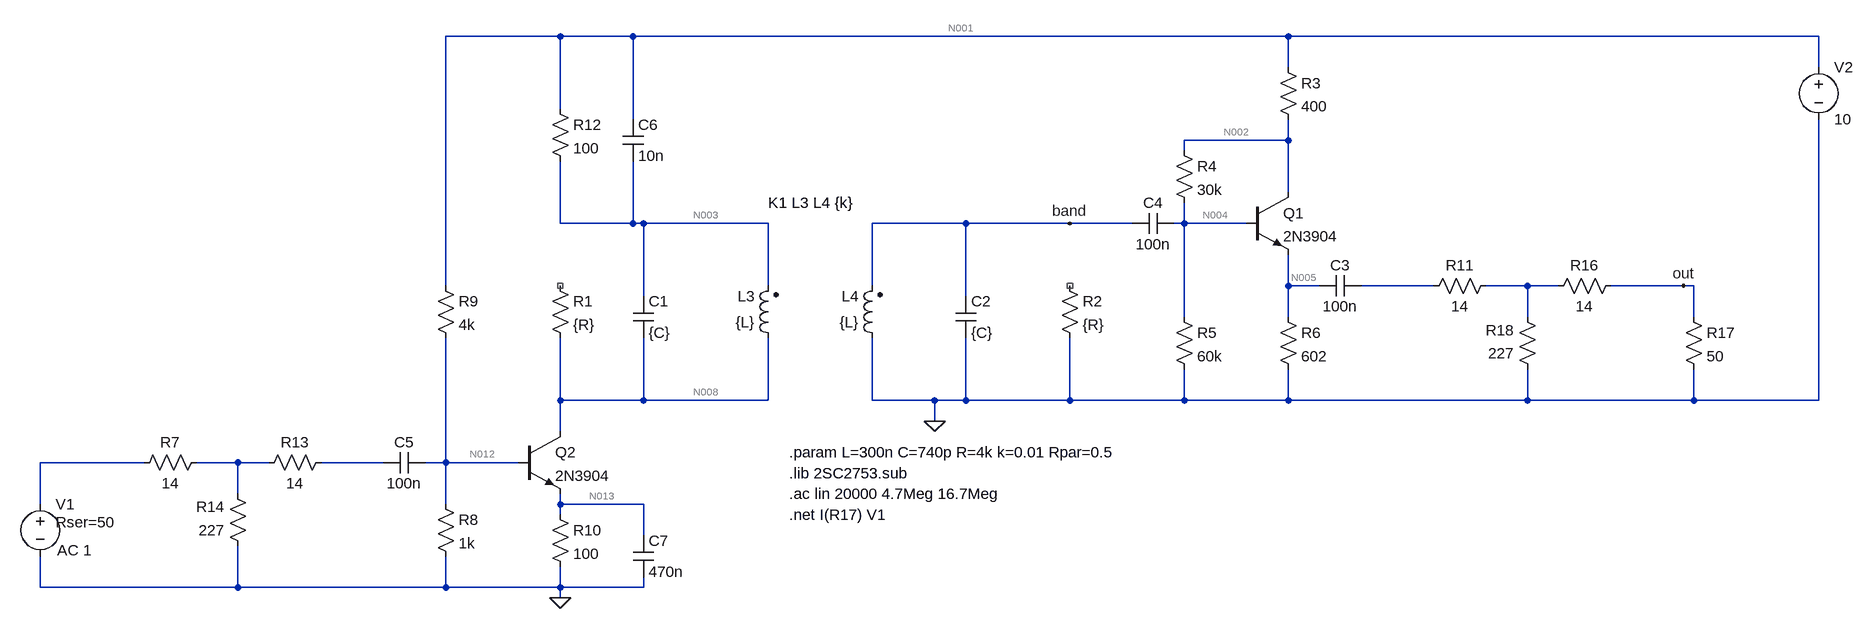
[diagram p0: schematic filter.asc]
filter.asc, the LTspice schematic file:
Version 4
SHEET 1 2536 760
WIRE 256 -176 80 -176
WIRE 368 -176 256 -176
WIRE 1376 -176 368 -176
WIRE 2192 -176 1376 -176
WIRE 1376 -128 1376 -176
WIRE 2192 -128 2192 -176
WIRE 256 -64 256 -176
WIRE 368 -48 368 -176
WIRE 1376 -16 1376 -48
WIRE 1376 -16 1216 -16
WIRE 1216 0 1216 -16
WIRE 1376 64 1376 -16
WIRE 256 112 256 16
WIRE 368 112 368 16
WIRE 368 112 256 112
WIRE 384 112 368 112
WIRE 576 112 384 112
WIRE 880 112 736 112
WIRE 1040 112 880 112
WIRE 1136 112 1040 112
WIRE 1216 112 1216 80
WIRE 1216 112 1200 112
WIRE 1312 112 1216 112
WIRE 80 208 80 -176
WIRE 576 208 576 112
WIRE 736 208 736 112
WIRE 1376 208 1376 160
WIRE 1424 208 1376 208
WIRE 1600 208 1488 208
WIRE 1744 208 1680 208
WIRE 1792 208 1744 208
WIRE 1984 208 1872 208
WIRE 2000 208 1984 208
WIRE 384 224 384 112
WIRE 880 224 880 112
WIRE 1216 256 1216 112
WIRE 1376 256 1376 208
WIRE 1744 256 1744 208
WIRE 2000 256 2000 208
WIRE 256 384 256 288
WIRE 384 384 384 288
WIRE 384 384 256 384
WIRE 576 384 576 288
WIRE 576 384 384 384
WIRE 736 384 736 288
WIRE 832 384 736 384
WIRE 880 384 880 288
WIRE 880 384 832 384
WIRE 1040 384 1040 288
WIRE 1040 384 880 384
WIRE 1216 384 1216 336
WIRE 1216 384 1040 384
WIRE 1376 384 1376 336
WIRE 1376 384 1216 384
WIRE 1744 384 1744 336
WIRE 1744 384 1376 384
WIRE 2000 384 2000 336
WIRE 2000 384 1744 384
WIRE 2192 384 2192 -48
WIRE 2192 384 2000 384
WIRE 832 416 832 384
WIRE 256 432 256 384
WIRE -384 480 -544 480
WIRE -240 480 -304 480
WIRE -192 480 -240 480
WIRE -16 480 -112 480
WIRE 80 480 80 288
WIRE 80 480 48 480
WIRE 192 480 80 480
WIRE -240 528 -240 480
WIRE -544 544 -544 480
WIRE 80 544 80 480
WIRE 256 544 256 528
WIRE 384 544 256 544
WIRE 256 560 256 544
WIRE 384 592 384 544
WIRE -544 672 -544 624
WIRE -240 672 -240 608
WIRE -240 672 -544 672
WIRE 80 672 80 624
WIRE 80 672 -240 672
WIRE 256 672 256 640
WIRE 256 672 80 672
WIRE 384 672 384 656
WIRE 384 672 256 672
WIRE 256 688 256 672
FLAG 256 688 0
FLAG 832 416 0
FLAG 1040 112 band
FLAG 1984 208 out
SYMBOL res 240 192 R0
SYMATTR InstName R1
SYMATTR Value {R}
SYMBOL cap 368 224 R0
SYMATTR InstName C1
SYMATTR Value {C}
SYMBOL cap 864 224 R0
SYMATTR InstName C2
SYMATTR Value {C}
SYMBOL res 1024 192 R0
SYMATTR InstName R2
SYMATTR Value {R}
SYMBOL ind2 592 304 R180
WINDOW 0 36 80 Left 2
WINDOW 3 36 40 Left 2
SYMATTR InstName L3
SYMATTR Value {L}
SYMATTR SpiceLine Rser=Rpar
SYMBOL ind2 752 304 R180
WINDOW 0 36 80 Left 2
WINDOW 3 36 40 Left 2
SYMATTR InstName L4
SYMATTR Value {L}
SYMATTR SpiceLine Rser=Rpar
SYMBOL npn 1312 64 R0
SYMATTR InstName Q1
SYMATTR Value 2N3904
SYMBOL res 1200 -16 R0
SYMATTR InstName R4
SYMATTR Value 30k
SYMBOL res 1200 240 R0
SYMATTR InstName R5
SYMATTR Value 60k
SYMBOL res 1360 240 R0
SYMATTR InstName R6
SYMATTR Value 602
SYMBOL voltage 2192 -144 R0
WINDOW 123 0 0 Left 0
WINDOW 39 0 0 Left 0
SYMATTR InstName V2
SYMATTR Value 10
SYMBOL cap 1488 192 R90
WINDOW 0 0 32 VBottom 2
WINDOW 3 32 32 VTop 2
SYMATTR InstName C3
SYMATTR Value 100n
SYMBOL cap 1200 96 R90
WINDOW 0 0 32 VBottom 2
WINDOW 3 32 32 VTop 2
SYMATTR InstName C4
SYMATTR Value 100n
SYMBOL res 1360 -144 R0
SYMATTR InstName R3
SYMATTR Value 400
SYMBOL res 64 528 R0
SYMATTR InstName R8
SYMATTR Value 1k
SYMBOL res 64 192 R0
SYMATTR InstName R9
SYMATTR Value 4k
SYMBOL cap 48 464 R90
WINDOW 0 0 32 VBottom 2
WINDOW 3 32 32 VTop 2
SYMATTR InstName C5
SYMATTR Value 100n
SYMBOL res 240 544 R0
SYMATTR InstName R10
SYMATTR Value 100
SYMBOL npn 192 432 R0
SYMATTR InstName Q2
SYMATTR Value 2N3904
SYMBOL res 240 -80 R0
SYMATTR InstName R12
SYMATTR Value 100
SYMBOL cap 352 -48 R0
SYMATTR InstName C6
SYMATTR Value 10n
SYMBOL cap 368 592 R0
SYMATTR InstName C7
SYMATTR Value 470n
SYMBOL res 1984 240 R0
SYMATTR InstName R17
SYMATTR Value 50
SYMBOL voltage -544 528 R0
WINDOW 123 26 87 Left 2
WINDOW 39 24 44 Left 2
SYMATTR Value2 AC 1
SYMATTR SpiceLine Rser=50
SYMATTR InstName V1
SYMATTR Value ""
SYMBOL res 1696 192 R90
WINDOW 0 0 56 VBottom 2
WINDOW 3 32 56 VTop 2
SYMATTR InstName R11
SYMATTR Value 14
SYMBOL res 1888 192 R90
WINDOW 0 0 56 VBottom 2
WINDOW 3 32 56 VTop 2
SYMATTR InstName R16
SYMATTR Value 14
SYMBOL res 1760 352 R180
WINDOW 0 36 76 Left 2
WINDOW 3 36 40 Left 2
SYMATTR InstName R18
SYMATTR Value 227
SYMBOL res -288 464 R90
WINDOW 0 0 56 VBottom 2
WINDOW 3 32 56 VTop 2
SYMATTR InstName R7
SYMATTR Value 14
SYMBOL res -96 464 R90
WINDOW 0 0 56 VBottom 2
WINDOW 3 32 56 VTop 2
SYMATTR InstName R13
SYMATTR Value 14
SYMBOL res -224 624 R180
WINDOW 0 36 76 Left 2
WINDOW 3 36 40 Left 2
SYMATTR InstName R14
SYMATTR Value 227
TEXT 576 80 Left 2 !K1 L3 L4 {k}
TEXT 608 528 Left 2 !.ac lin 20000 4.7Meg 16.7Meg
TEXT 608 496 Left 2 !.lib 2SC2753.sub
TEXT 608 464 Left 2 !.param L=300n C=740p R=4k k=0.01 Rpar=0.5
TEXT 608 560 Left 2 !.net I(R17) V1

The netlist it stands for:
* filter.asc
R1 NC_01 N008 {R}
C1 N003 N008 {C}
C2 band 0 {C}
R2 NC_02 0 {R}
L3 N008 N003 {L} Rser=Rpar
L4 0 band {L} Rser=Rpar
Q1 N002 N004 N005 0 2N3904
R4 N002 N004 30k
R5 N004 0 60k
R6 N005 0 602
V2 N001 0 10
C3 N006 N005 100n
C4 N004 band 100n
R3 N001 N002 400
R8 N012 0 1k
R9 N001 N012 4k
C5 N012 N011 100n
R10 N013 0 100
Q2 N008 N012 N013 0 2N3904
R12 N001 N003 100
C6 N001 N003 10n
C7 N013 0 470n
R17 out 0 50
V1 N009 0 AC 1 Rser=50
R11 N007 N006 14
R16 out N007 14
R18 0 N007 227
R7 N010 N009 14
R13 N011 N010 14
R14 0 N010 227
.model NPN NPN
.model PNP PNP
.lib standard.bjt
K1 L3 L4 {k}
.ac lin 20000 4.7Meg 16.7Meg
.lib 2SC2753.sub
.param L=300n C=740p R=4k k=0.01 Rpar=0.5
.net I(R17) V1
.backanno
.end

* Results of the author's LTspice run, read from the files saved beside the schematic
* Operating Point, zero values left out:
*   V(n008) = 8.751 V
*   V(n003) = 8.757 V
*   V(n002) = 7.425 V
*   V(n004) = 4.533 V
*   V(n005) = 3.829 V
*   V(n001) = 10 V
*   V(n012) = 1.968 V
*   V(n013) = 1.247 V
*   Ic(Q2) = 12.43 mA
*   Ib(Q2) = 39.92 µA
*   Ie(Q2) = -12.47 mA
*   Ic(Q1) = 6.34 mA
*   Ib(Q1) = 20.86 µA
*   Ie(Q1) = -6.361 mA
*   I(L3) = -12.43 mA
*   I(R12) = 12.43 mA
*   I(R10) = 12.47 mA
*   I(R9) = 2.008 mA
*   I(R8) = 1.968 mA
*   I(R3) = 6.437 mA
*   I(R6) = 6.361 mA
*   I(R5) = 75.55 µA
*   I(R4) = 96.41 µA
*   I(V2) = -20.87 mA